# Altium schematic sheet Schematic_L0.SchDoc: EEROS: Adapter for NTB SCARA
size A3; Author: Martin Zueger; CompanyName: Company Name; Organization: Interstate University of Applied; Address1: Werdenbergstrasse 4; Address3: 9470 Buchs; Address4: Switzerland; Revision: 0.1; SheetNumber: 1; SheetTotal: 3; Organization1: Sciences of Technology Buchs; Description: Main sheet for lower board; ProjectName: EEROS
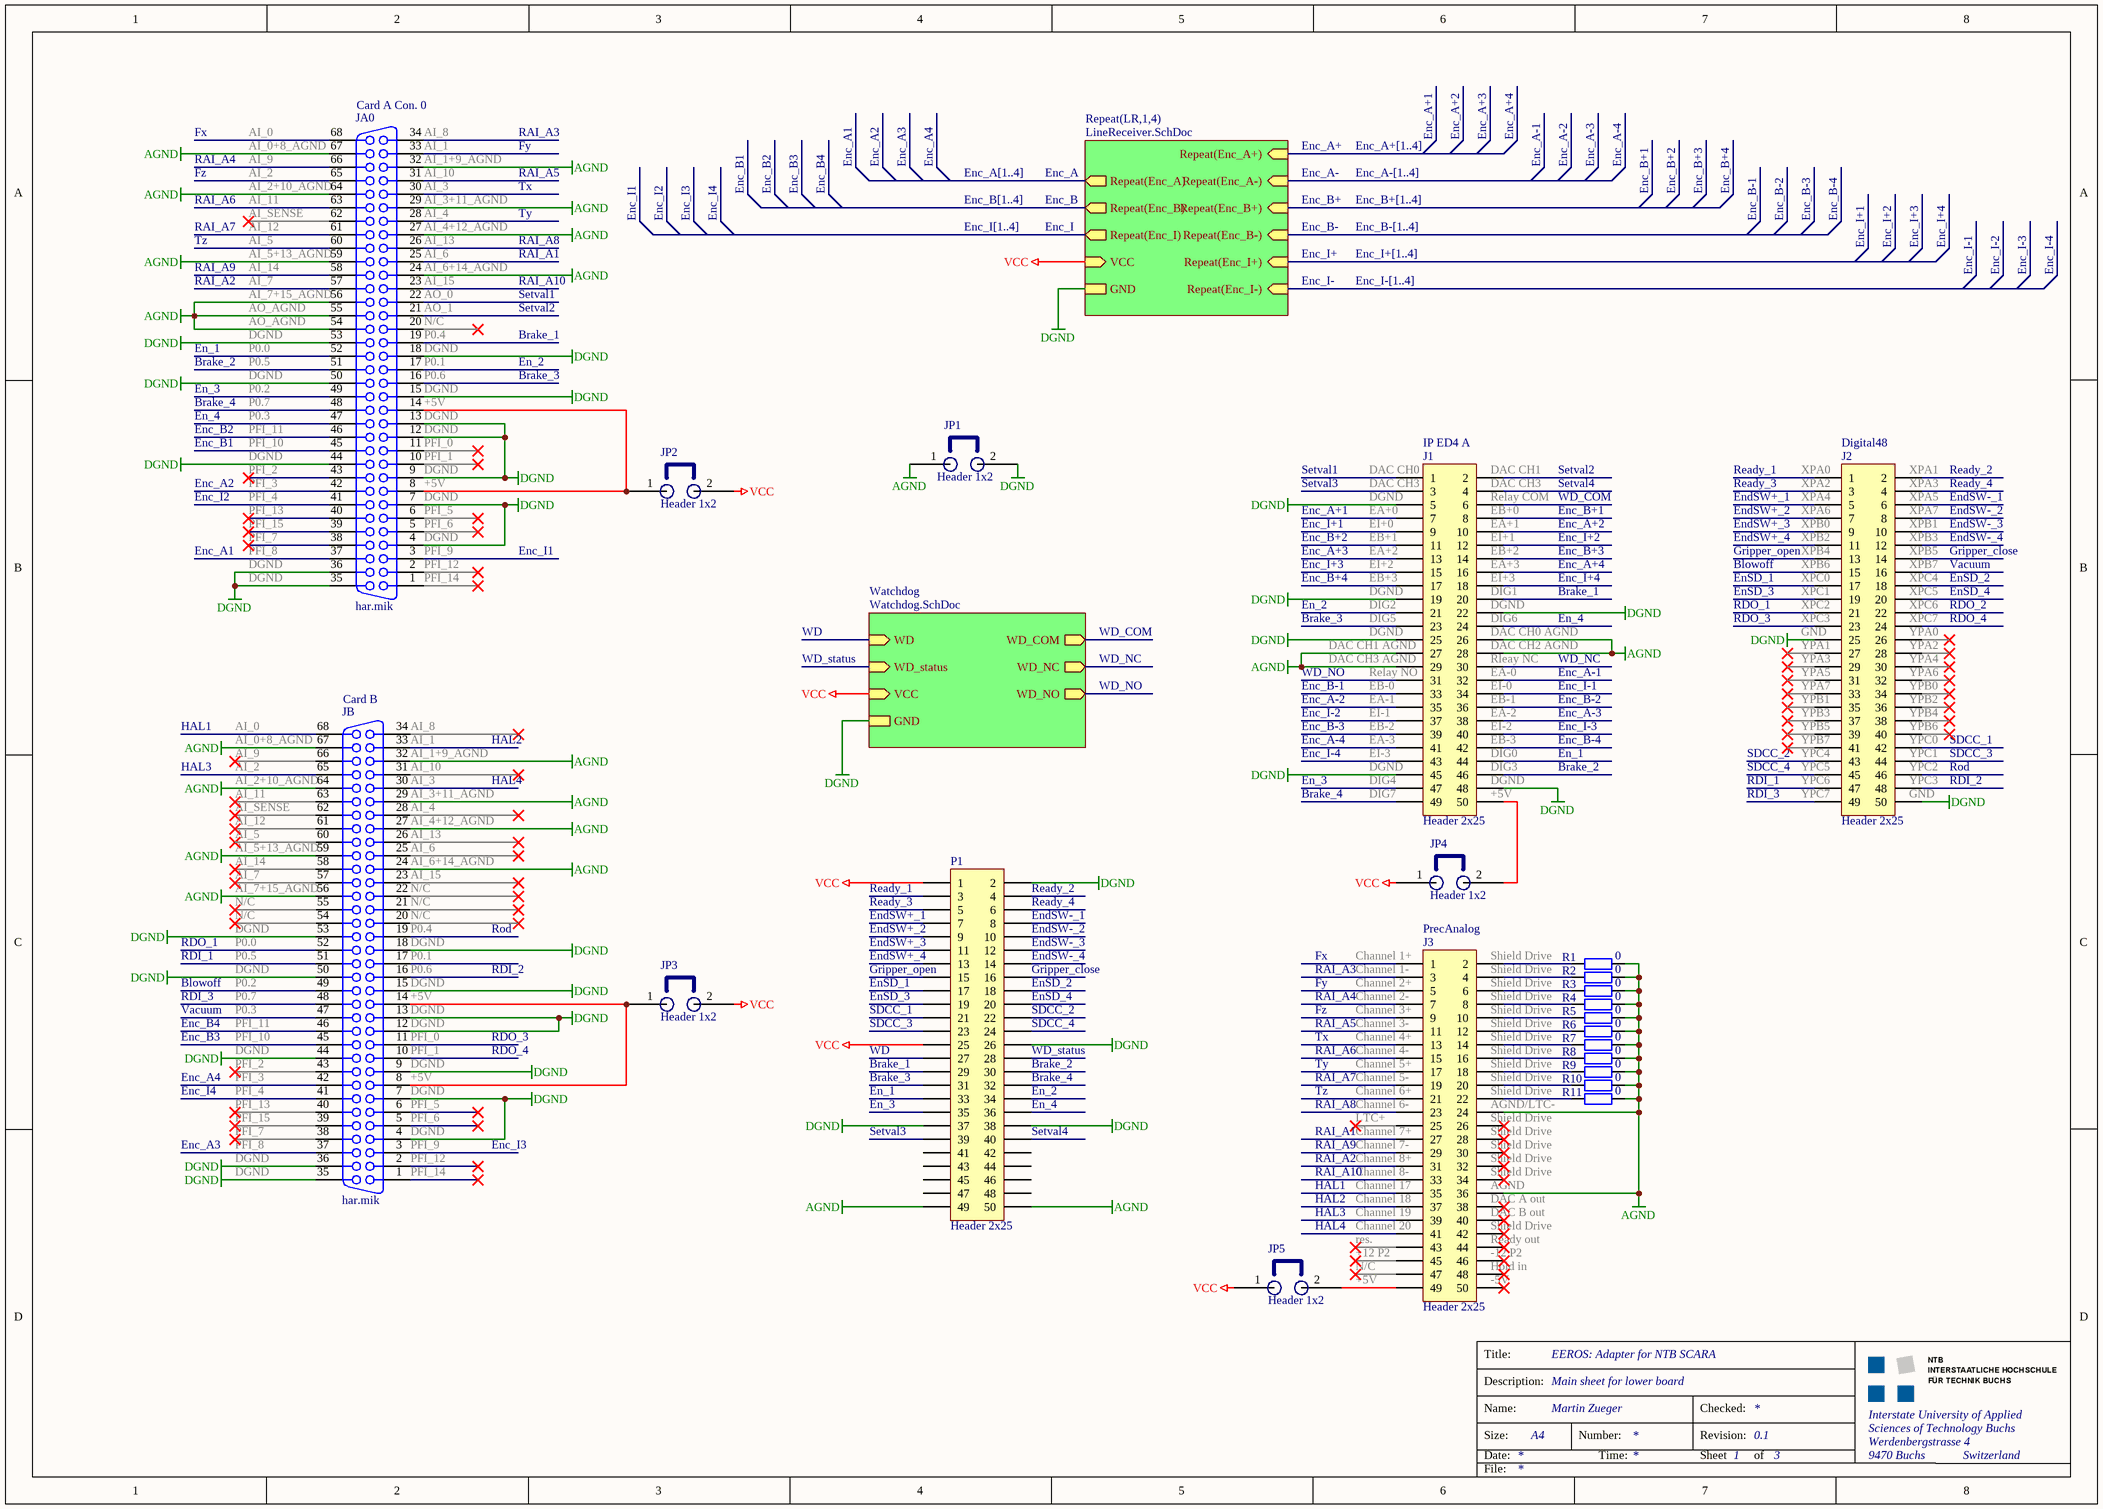
[diagram p0: Schematic_L0.SchDoc]

## Parts
J1  Header 2x25  [Header - 2x25 - Boxed]
J2  Header 2x25  [Header - 2x25 - Boxed]
J3  Header 2x25  [Header - 2x25 - Boxed]
JA0  har.mik  [HAR-MIK P/S 68 SA]
JB  har.mik  [HAR-MIK P/S 68 SA]
JP1  Header 1x2  [Header - 1x2 - V]
JP2  Header 1x2  [Header - 1x2 - V]
JP3  Header 1x2  [Header - 1x2 - V]
JP4  Header 1x2  [Header - 1x2 - V]
JP5  Header 1x2  [Header - 1x2 - V]
P1  Header 2x25  [Header - 2x25 - V]
R1  0  [0805]
R2  0  [0805]
R3  0  [0805]
R4  0  [0805]
R5  0  [0805]
R6  0  [0805]
R7  0  [0805]
R8  0  [0805]
R9  0  [0805]
R10  0  [0805]
R11  0  [0805]

## Sub-sheets
Repeat(LR,1,4) = LineReceiver.SchDoc: Repeat(Enc_A), Repeat(Enc_B), Repeat(Enc_I), Repeat(Enc_A+) (in), Repeat(Enc_B+), Repeat(Enc_B-), Repeat(Enc_I+), Repeat(Enc_I-), Repeat(Enc_A-), VCC, GND
Watchdog = Watchdog.SchDoc: WD_COM, WD_NC, WD_NO, WD, VCC, GND, WD_status

## Nets
AGND: J1.26 J1.27 J1.28 J1.29 J3.24 J3.36 JA0.24 JA0.27 JA0.29 JA0.32 JA0.54 JA0.55 JA0.56 JA0.59 JA0.64 JA0.67 JB.24 JB.27 JB.29 JB.32 JB.56 JB.59 JB.64 JB.67 JP1.1 P1.49 P1.50 R1.2 R2.2 R3.2 R4.2 R5.2 R6.2 R7.2 R8.2 R9.2 R10.2 R11.2
DGND: J1.5 J1.19 J1.22 J1.25 J1.45 J1.48 J2.25 J2.50 JA0.4 JA0.7 JA0.9 JA0.12 JA0.13 JA0.15 JA0.18 JA0.35 JA0.36 JA0.44 JA0.50 JA0.53 JB.4 JB.7 JB.9 JB.12 JB.13 JB.15 JB.18 JB.35 JB.36 JB.44 JB.50 JB.53 JP1.2 P1.2 P1.26 P1.37 P1.38 ; sheet Repeat(LR,1,4)/GND, sheet Watchdog/GND
VCC: JP2.2 JP3.2 JP4.1 JP5.1 P1.1 P1.25 ; sheet Repeat(LR,1,4)/VCC, sheet Watchdog/VCC
Blowoff: J2.15 JB.49
Brake_1: J1.20 JA0.19 P1.29
Brake_2: J1.46 JA0.51 P1.30
Brake_3: J1.23 JA0.16 P1.31
Brake_4: J1.49 JA0.48 P1.32
En_1: J1.44 JA0.52 P1.33
En_2: J1.21 JA0.17 P1.34
En_3: J1.47 JA0.49 P1.35
En_4: J1.24 JA0.47 P1.36
Enc_A: sheet Repeat(LR,1,4)/Repeat(Enc_A)
Enc_A1: JA0.37
Enc_A2: JA0.42
Enc_A3: JB.37
Enc_A4: JB.42
Enc_A+: sheet Repeat(LR,1,4)/Repeat(Enc_A+)
Enc_A+1: J1.7
Enc_A+2: J1.10
Enc_A+3: J1.13
Enc_A+4: J1.16
Enc_A-: sheet Repeat(LR,1,4)/Repeat(Enc_A-)
Enc_A-1: J1.32
Enc_A-2: J1.35
Enc_A-3: J1.38
Enc_A-4: J1.41
Enc_B: sheet Repeat(LR,1,4)/Repeat(Enc_B)
Enc_B1: JA0.45
Enc_B2: JA0.46
Enc_B3: JB.45
Enc_B4: JB.46
Enc_B+: sheet Repeat(LR,1,4)/Repeat(Enc_B+)
Enc_B+1: J1.8
Enc_B+2: J1.11
Enc_B+3: J1.14
Enc_B+4: J1.17
Enc_B-: sheet Repeat(LR,1,4)/Repeat(Enc_B-)
Enc_B-1: J1.33
Enc_B-2: J1.36
Enc_B-3: J1.39
Enc_B-4: J1.42
Enc_I: sheet Repeat(LR,1,4)/Repeat(Enc_I)
Enc_I1: JA0.3
Enc_I2: JA0.41
Enc_I3: JB.3
Enc_I4: JB.41
Enc_I+: sheet Repeat(LR,1,4)/Repeat(Enc_I+)
Enc_I+1: J1.9
Enc_I+2: J1.12
Enc_I+3: J1.15
Enc_I+4: J1.18
Enc_I-: sheet Repeat(LR,1,4)/Repeat(Enc_I-)
Enc_I-1: J1.34
Enc_I-2: J1.37
Enc_I-3: J1.40
Enc_I-4: J1.43
EndSW+_1: J2.5 P1.7
EndSW+_2: J2.7 P1.9
EndSW+_3: J2.9 P1.11
EndSW+_4: J2.11 P1.13
EndSW-_1: J2.6 P1.8
EndSW-_2: J2.8 P1.10
EndSW-_3: J2.10 P1.12
EndSW-_4: J2.12 P1.14
EnSD_1: J2.17 P1.17
EnSD_2: J2.18 P1.18
EnSD_3: J2.19 P1.19
EnSD_4: J2.20 P1.20
Fx: J3.1 JA0.68
Fy: J3.5 JA0.33
Fz: J3.9 JA0.65
Gripper_close: J2.14 P1.16
Gripper_open: J2.13 P1.15
HAL1: J3.35 JB.68
HAL2: J3.37 JB.33
HAL3: J3.39 JB.65
HAL4: J3.41 JB.30
RAI_A1: J3.27 JA0.25
RAI_A2: J3.31 JA0.57
RAI_A3: J3.3 JA0.34
RAI_A4: J3.7 JA0.66
RAI_A5: J3.11 JA0.31
RAI_A6: J3.15 JA0.63
RAI_A7: J3.19 JA0.61
RAI_A8: J3.23 JA0.26
RAI_A9: J3.29 JA0.58
RAI_A10: J3.33 JA0.23
RDI_1: J2.47 JB.51
RDI_2: J2.48 JB.16
RDI_3: J2.49 JB.48
RDO_1: J2.21 JB.52
RDO_2: J2.22
RDO_3: J2.23 JB.11
RDO_4: J2.24 JB.10
Ready_1: J2.1 P1.3
Ready_2: J2.2 P1.4
Ready_3: J2.3 P1.5
Ready_4: J2.4 P1.6
Rod: J2.46 JB.19
SDCC_1: J2.42 P1.21
SDCC_2: J2.43 P1.22
SDCC_3: J2.44 P1.23
SDCC_4: J2.45 P1.24
Setval1: J1.1 JA0.22
Setval2: J1.2 JA0.21
Setval3: J1.3 P1.39
Setval4: J1.4 P1.40
Tx: J3.13 JA0.30
Ty: J3.17 JA0.28
Tz: J3.21 JA0.60
Vacuum: J2.16 JB.47
WD: P1.27 ; sheet Watchdog/WD
WD_COM: J1.6 ; sheet Watchdog/WD_COM
WD_NC: J1.30 ; sheet Watchdog/WD_NC
WD_NO: J1.31 ; sheet Watchdog/WD_NO
WD_status: P1.28 ; sheet Watchdog/WD_status
NetJ1_50: J1.50 JP4.2
NetJ3_2: J3.2 R1.1
NetJ3_4: J3.4 R2.1
NetJ3_6: J3.6 R3.1
NetJ3_8: J3.8 R4.1
NetJ3_10: J3.10 R5.1
NetJ3_12: J3.12 R6.1
NetJ3_14: J3.14 R7.1
NetJ3_16: J3.16 R8.1
NetJ3_18: J3.18 R9.1
NetJ3_20: J3.20 R10.1
NetJ3_22: J3.22 R11.1
NetJ3_49: J3.49 JP5.2
NetJA0_8: JA0.8 JA0.14 JP2.1
NetJB_8: JB.8 JB.14 JP3.1

Not connected (* = marked no-connect by the designer): J2 26* 27* 28* 29* 30* 31* 32* 33* 34* 35* 36* 37* 38* 39* 40* 41*; J3 25* 26* 28* 30* 32* 34* 38* 40* 42* 43* 44* 45* 46* 47* 48* 50*; JA0 1* 2* 5* 6* 10* 11* 20* 38* 39* 40* 43* 62*; JB 1* 2* 5* 6* 17 20* 21* 22* 23* 25* 26* 28* 31* 34* 38* 39* 40* 43* 54* 55* 57* 58* 60* 61* 62* 63* 66*; P1 41 42 43 44 45 46 47 48

## Buses and harness runs
bus Enc_A+[1..4]
bus Enc_A-[1..4]
bus Enc_A[1..4]
bus Enc_B+[1..4]
bus Enc_B-[1..4]
bus Enc_B[1..4]
bus Enc_I+[1..4]
bus Enc_I-[1..4]
bus Enc_I[1..4]

## Notes on the sheet
- (near JA0) Card A Con. 0
- AI_0
- AI_9
- AI_2
- (near JA0) AI_0+8_AGND
- (near JA0) AI_8
- (near JA0) AI_1
- (near JA0) AI_1+9_AGND
- (near JA0) AI_10
- AI_11
- AI_SENSE
- AI_12
- AI_5
- (near JA0) AI_2+10_AGND
- (near JA0) AI_3
- (near JA0) AI_3+11_AGND
- (near JA0) AI_4
- (near JA0) AI_4+12_AGND
- (near JA0) AI_13
- AI_14
- AI_7
- AO_AGND
- (near JA0) AI_7+15_AGND
- (near JA0) AI_5+13_AGND
- (near JA0) AI_6
- (near JA0) AI_6+14_AGND
- (near JA0) AI_15
- (near JA0) AO_0
- (near JA0) AO_1
- P0.0
- P0.5
- DGND
- (near JA0) N/C
- (near JA0) P0.4
- (near JA0) DGND
- (near JA0) P0.1
- (near JA0) P0.6
- P0.2
- P0.7
- P0.3
- PFI_11
- PFI_10
- (near JA0) +5V
- (near JA0) PFI_0
- (near J1) IP ED4 A
- (near J2) Digital48
- PFI_2
- PFI_3
- PFI_4
- PFI_13
- (near JA0) PFI_1
- (near JA0) PFI_5
- (near J1) DAC CH0
- (near J1) DAC CH3
- (near J1) DGND
- (near J1) EA+0
- (near J1) DAC CH1
- (near J1) Relay COM
- (near J1) EB+0
- (near J2) XPA0
- (near J2) XPA2
- (near J2) XPA4
- (near J2) XPA6
- (near J2) XPA1
- (near J2) XPA3
- (near J2) XPA5
- (near J2) XPA7
- PFI_15
- PFI_7
- PFI_8
- (near JA0) PFI_6
- (near JA0) PFI_9
- (near JA0) PFI_12
- (near JA0) PFI_14
- (near J1) EB+3
- (near J1) EI+2
- (near J1) EA+2
- (near J1) EB+1
- (near J1) EI+0
- (near J1) EA+1
- (near J1) EI+1
- (near J1) EB+2
- (near J1) EA+3
- (near J1) EI+3
- (near J2) XPB0
- (near J2) XPB2
- (near J2) XPB4
- (near J2) XPB6
- (near J2) XPC0
- (near J2) XPB1
- (near J2) XPB3
- (near J2) XPB5
- (near J2) XPB7
- (near J2) XPC4
- (near J1) DAC CH1 AGND
- (near J1) DIG5
- (near J1) DIG2
- (near J1) DAC CH0 AGND
- (near J1) DAC CH2 AGND
- (near J1) DIG1
- (near J1) DIG6
- (near J2) XPC1
- (near J2) XPC2
- (near J2) XPC3
- (near J2) GND
- (near J2) YPA1
- (near J2) XPC5
- (near J2) XPC6
- (near J2) XPC7
- (near J2) YPA0
- (near J2) YPA2
- (near JB) Card B
- (near J1) DAC CH3 AGND
- (near J1) Relay NO
- (near J1) EI-1
- (near J1) EA-1
- (near J1) EB-0
- (near J1) Rleay NC
- (near J1) EA-0
- (near J1) EI-0
- (near J1) EB-1
- (near J1) EA-2
- (near J2) YPA3
- (near J2) YPA5
- (near J2) YPA7
- (near J2) YPB1
- (near J2) YPB3
- (near J2) YPA4
- (near J2) YPA6
- (near J2) YPB0
- (near J2) YPB2
- (near J2) YPB4
- (near JB) AI_2+10_AGND
- (near JB) AI_0+8_AGND
- (near JB) AI_8
- (near JB) AI_1
- (near JB) AI_1+9_AGND
- (near JB) AI_10
- (near JB) AI_3
- (near J1) DIG4
- (near J1) EI-3
- (near J1) EA-3
- (near J1) EB-2
- (near J1) EI-2
- (near J1) EB-3
- (near J1) DIG0
- (near J1) DIG3
- (near J2) YPB5
- (near J2) YPB7
- (near J2) YPC4
- (near J2) YPC5
- (near J2) YPC6
- (near J2) YPB6
- (near J2) YPC0
- (near J2) YPC1
- (near J2) YPC2
- (near J2) YPC3
- (near JB) AI_5+13_AGND
- (near JB) AI_3+11_AGND
- (near JB) AI_4
- (near JB) AI_4+12_AGND
- (near JB) AI_13
- (near JB) AI_6
- (near J1) DIG7
- (near J1) +5V
- (near J2) YPC7
- (near JB) AI_7+15_AGND
- N/C
- (near JB) N/C
- (near JB) AI_6+14_AGND
- (near JB) AI_15
- (near JB) P0.4
- (near JB) DGND
- (near JB) P0.1
- (near JB) P0.6
- (near J3) Channel 1+
- (near J3) Channel 1-
- (near J3) Channel 2+
- PrecAnalog
- Shield Drive
- (near JB) +5V
- (near JB) PFI_0
- (near JB) PFI_1
- (near J3) Channel 2-
- (near J3) Channel 3+
- (near J3) Channel 3-
- (near J3) Channel 4+
- (near J3) Channel 4-
- (near JB) PFI_5
- (near JB) PFI_6
- (near J3) Channel 5+
- (near J3) Channel 5-
- (near J3) Channel 6+
- (near J3) Channel 6-
- (near J3) LTC+
- (near J3) AGND/LTC-
- (near J3) Shield Drive
- (near JB) PFI_9
- (near JB) PFI_12
- (near JB) PFI_14
- (near J3) Channel 7+
- (near J3) Channel 7-
- (near J3) Channel 8+
- (near J3) Channel 8-
- (near J3) Channel 17
- (near J3) AGND
- (near J3) Channel 18
- (near J3) Channel 19
- (near J3) Channel 20
- res.
- (near J3) +12 P2
- (near J3) DAC A out
- (near J3) DAC B out
- (near J3) Ready out
- (near J3) -12 P2
- +5V
- (near J3) Hold in
- (near J3) -5V
- Title:
- Description:
- Size:
- Date:
- Name:
- A4
- Number:
- Time:
- Revision:
- Sheet
- Checked:
- of
- File:

## Library data of the parts
J1-J3 P1 = Header 2x25: Header, 25-Pin, Dual row; LatestRevisionDate: 17-Jul-2002; LatestRevisionNote: Re-released for DXP Platform.; Publisher: Altium Limited
JA0 JB = Connector 68: TB 60 01 068 5232; PackageDocument: B; Positions: 68; Published: 15-Jun-2001; LatestRevisionDate: 17-Jul-2002; LatestRevisionNote: Re-released for DXP Platform.; DatasheetDocument: 1-Oct-1983; PackageReference: 178240-8; Publisher: Altium Limited; Orientation: Right Angle
JP1-JP5 = Jumper
R1-R11 = R: Resistor; #Manufacturer: Generic Components; #Publisher: Dr. A. Heinzelmann; #Class: Passive; #Published: 2006-10-06; #ClassSub: Resistor; Value: 0